# Altium schematic sheet Tag-panel.SchDoc
size Letter; Author: Mohamad Katanbaf; Organization: University of Washington; Address1: Sensor Systems Lab; Address2: Paul Allen Center,; Address3: 185 E Stevens Way NE; Address4: Seattle, WA, 98105; Revision: 1.0
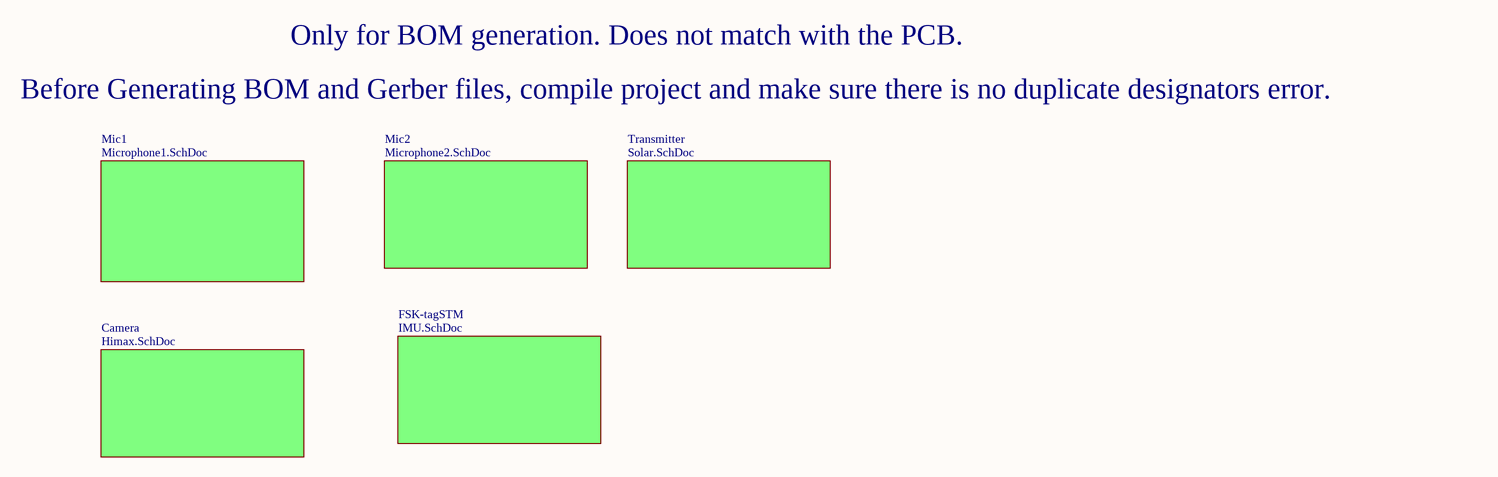
[diagram p0: Tag-panel.SchDoc]

## Sub-sheets
Camera = Himax.SchDoc: no entries
FSK-tagSTM = IMU.SchDoc: no entries
Mic1 = Microphone1.SchDoc: no entries
Mic2 = Microphone2.SchDoc: no entries
Transmitter = Solar.SchDoc: no entries

## Notes on the sheet
- Only for BOM generation. Does not match with the PCB.
- Before Generating BOM and Gerber files, compile project and make sure there is no duplicate designators error.
- Title
- Date:
- Project
- Revision:
- Sheet
- of
- Author: